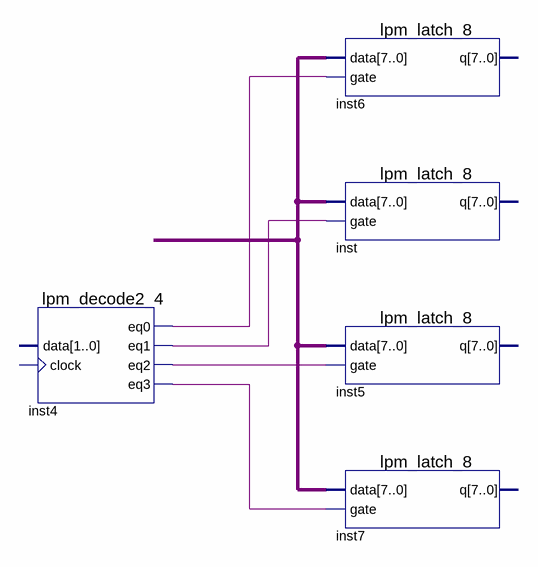
[diagram p0: schematic sheet]
// Quartus schematic reg.bdf as structural Verilog: 5 symbols, 0 pins
module \reg  (
);

  wire inst4_eq0, inst4_eq1, inst4_eq2, inst4_eq3;
  wire [7:0] undriven;

  lpm_decode2_4 inst4 (.eq0(inst4_eq0), .eq1(inst4_eq1), .eq2(inst4_eq2), .eq3(inst4_eq3));  // open: data, clock
  lpm_latch_8 inst6 (.data(undriven), .gate(inst4_eq0));  // open: q
  lpm_latch_8 inst (.data(undriven), .gate(inst4_eq1));  // open: q
  lpm_latch_8 inst5 (.data(undriven), .gate(inst4_eq2));  // open: q
  lpm_latch_8 inst7 (.data(undriven), .gate(inst4_eq3));  // open: q
endmodule
